# Altium schematic sheet LowCurrent.SchDoc
size A
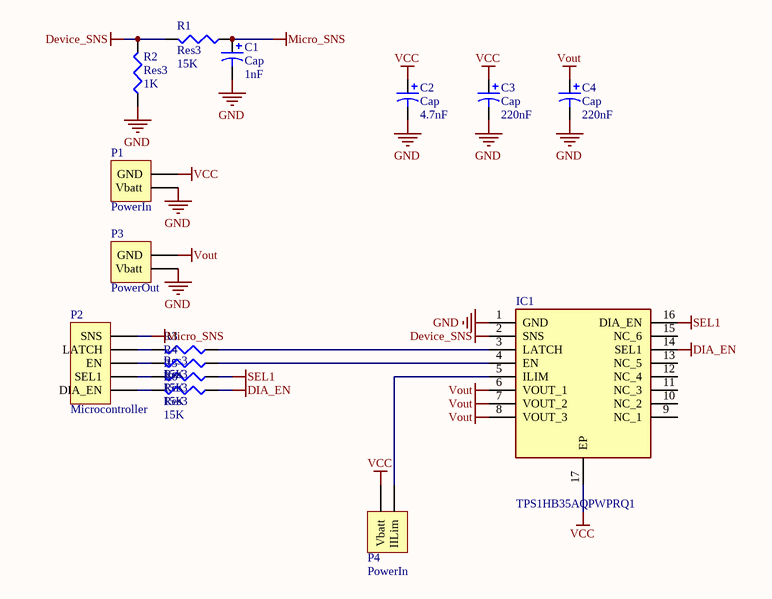
[diagram p0: LowCurrent.SchDoc]

## Parts
C1  Cap  value 1nF  [C0805]
C2  Cap  value 4.7nF  [C0805]
C3  Cap  value 220nF  [C0805]
C4  Cap  value 220nF  [C0805]
IC1  TPS1HB35AQPWPRQ1  [SOP65P640X120-17N]
P1  PowerIn  [HDR1X2]
P2  Microcontroller  [HDR1X5]
P3  PowerOut  [HDR1X2]
P4  PowerIn  [HDR1X2]
R1  Res3  value 15K  [J1-0603]
R2  Res3  value 1K  [J1-0603]
R3  Res3  value 15K  [J1-0603]
R4  Res3  value 15K  [J1-0603]
R5  Res3  value 15K  [J1-0603]
R6  Res3  value 15K  [J1-0603]

## Nets
Device_SNS: IC1.2(SNS) R1.2 R2.2
DIA_EN: IC1.14(SEL1) R6.1
GND: C1.2 C2.2 C3.2 C4.2 IC1.1(GND) P1.1(Vbatt) P3.1(Vbatt) R2.1
Micro_SNS: C1.1 P2.1(SNS) R1.1
SEL1: IC1.16(DIA_EN) R5.1
VCC: C2.1 C3.1 IC1.17(EP) P1.2(GND) P4.2(Vbatt)
Vout: C4.1 IC1.6(VOUT_1) IC1.7(VOUT_2) IC1.8(VOUT_3) P3.2(GND)
NetIC1_3: IC1.3(LATCH) R3.1
NetIC1_4: IC1.4(EN) R4.1
NetIC1_5: IC1.5(ILIM) P4.1(IILim)
NetP2_2: P2.2(LATCH) R3.2
NetP2_3: P2.3(EN) R4.2
NetP2_4: P2.4(SEL1) R5.2
NetP2_5: P2.5(DIA_EN) R6.2

Not connected (* = marked no-connect by the designer): IC1 9(NC_1) 10(NC_2) 11(NC_3) 12(NC_4) 13(NC_5) 15(NC_6)

## Library data of the parts
C1-C4 = Cap Pol3: Polarized Capacitor (Surface Mount); Published: 8-Jun-2000; LatestRevisionDate: 29-May-2009; LatestRevisionNote: IPC-7351 Footprint Added.; PackageReference: C0805; Publisher: Altium Limited; PackageDescription: Chip Capacitor
IC1 = TPS1HB35AQPWPRQ1: Integrated Circuit; Manufacturer_Name: Texas Instruments; Datasheet Link: https://www.ti.com/lit/ds/symlink/tps1hb35-q1.pdf?ts=1623228312677&ref_url=https%253A%252F%252Fwww.google.com%252F; Height: 1.2mm; Manufacturer_Part_Number: TPS1HB35AQPWPRQ1; Mouser Part Number: 595-TPS1HB35AQPWPRQ1; Mouser Price/Stock: https://www.mouser.co.uk/ProductDetail/Texas-Instruments/TPS1HB35AQPWPRQ1?qs=KUoIvG%2F9IlYFS2ZDCuDTOg%3D%3D
P1 P3 P4 = Header 2: Power Header; LatestRevisionDate: 17-Jul-2002; LatestRevisionNote: Re-released for DXP Platform.; Publisher: Altium Limited
P2 = Header 5: Header, 5-Pin; LatestRevisionDate: 17-Jul-2002; LatestRevisionNote: Re-released for DXP Platform.; Publisher: Altium Limited
R1-R6 = Res3: Resistor; Published: 8-Jun-2000; LatestRevisionDate: 29-May-2009; LatestRevisionNote: IPC-7351 Footprint Added.; PackageReference: J1-0603; Publisher: Altium Limited; PackageDescription: Chip Resistor